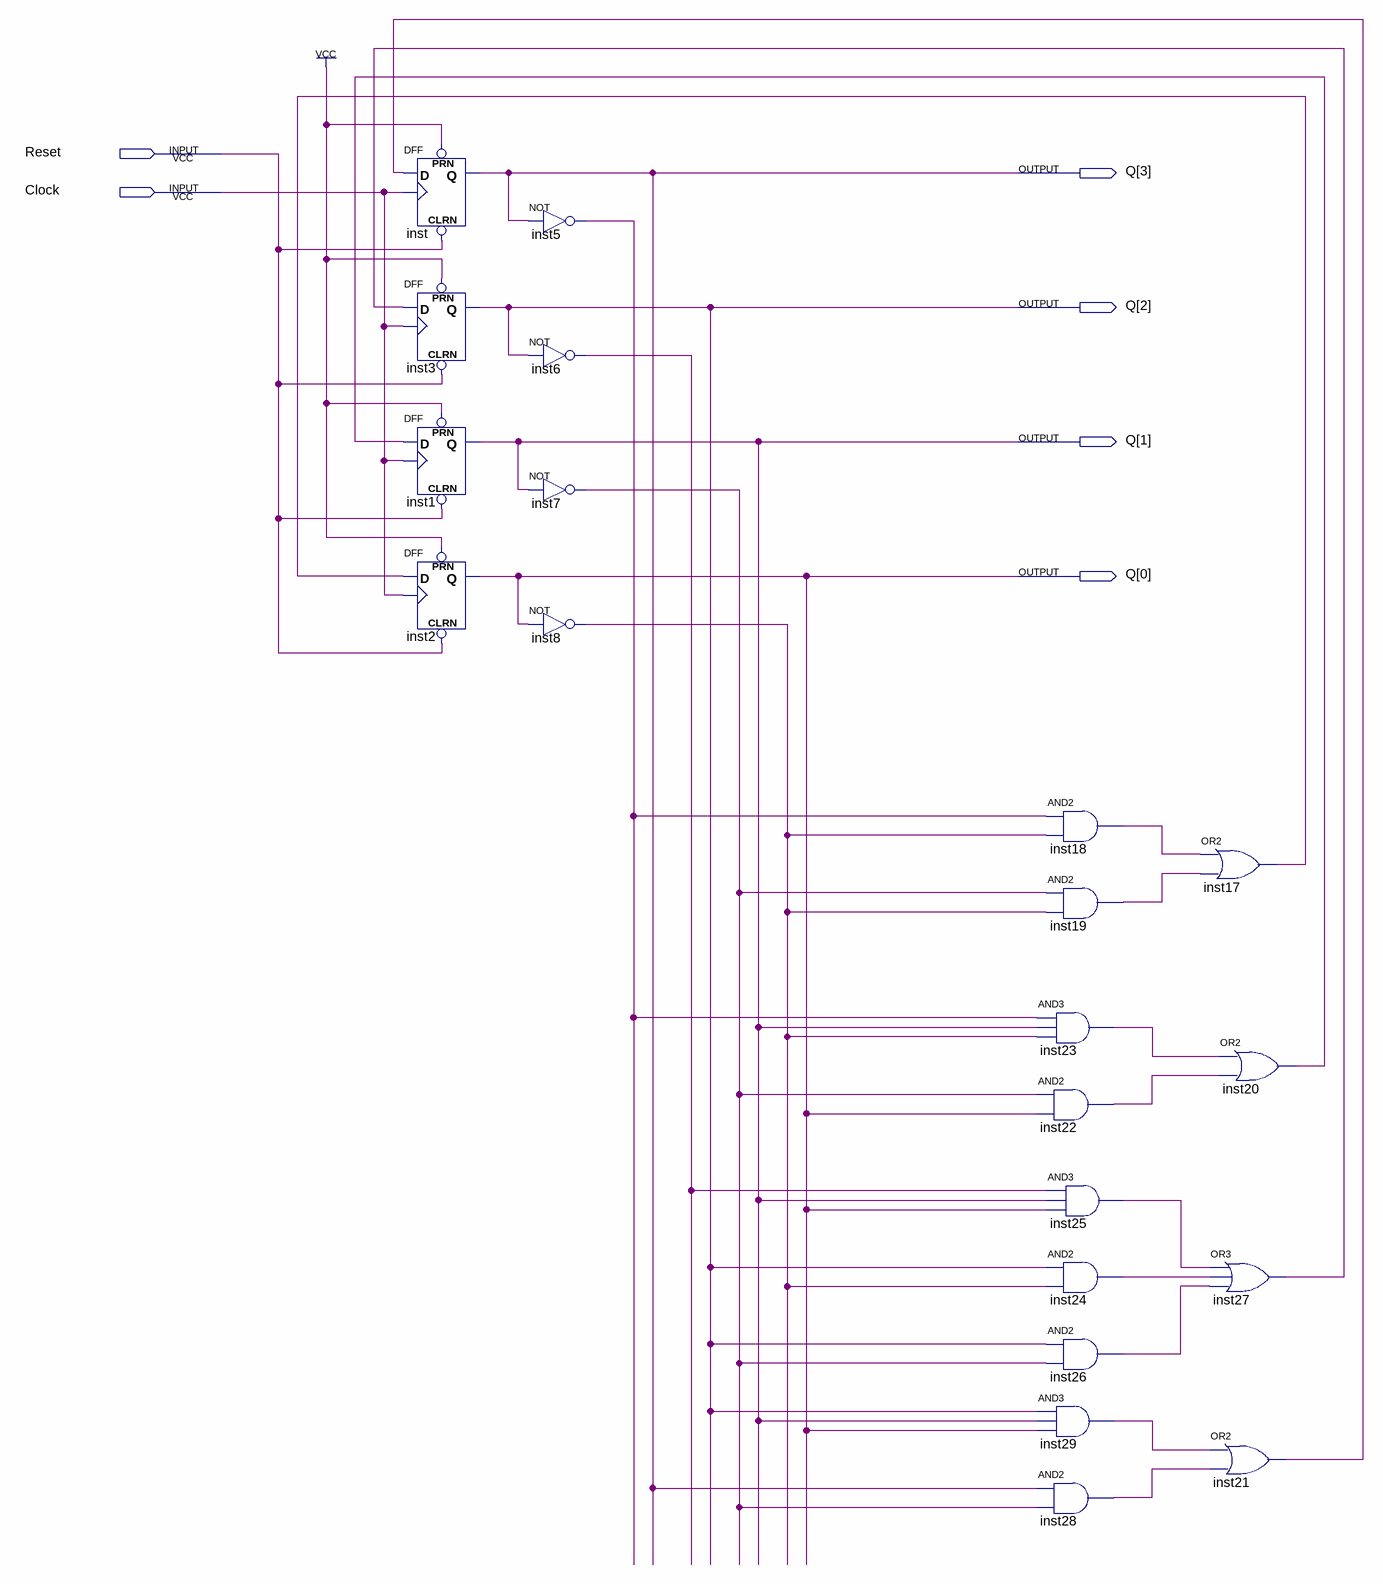
[diagram p0: schematic sheet]
// Quartus schematic Contsic.bdf as structural Verilog: 21 symbols, 6 pins
module Contsic (
  input  Reset,
  input  Clock,
  output [3:0] Q
);

  wire inst5_out, inst6_out, inst7_out, inst8_out, inst17_out, inst18_out, inst19_out, inst20_out,
       inst21_out, inst22_out, inst23_out, inst24_out, inst25_out, inst26_out, inst27_out, inst28_out,
       inst29_out;

  DFF inst (.CLRN(Reset), .CLK(Clock), .D(inst21_out), .PRN(1'b1), .Q(Q[3]));
  DFF inst3 (.CLRN(Reset), .CLK(Clock), .D(inst27_out), .PRN(1'b1), .Q(Q[2]));
  DFF inst1 (.CLRN(Reset), .CLK(Clock), .D(inst20_out), .PRN(1'b1), .Q(Q[1]));
  DFF inst2 (.CLRN(Reset), .CLK(Clock), .D(inst17_out), .PRN(1'b1), .Q(Q[0]));
  not inst5 (inst5_out, Q[3]);
  not inst6 (inst6_out, Q[2]);
  not inst7 (inst7_out, Q[1]);
  not inst8 (inst8_out, Q[0]);
  and inst18 (inst18_out, inst5_out, inst8_out);
  and inst19 (inst19_out, inst7_out, inst8_out);
  and inst23 (inst23_out, inst5_out, Q[1], inst8_out);
  and inst22 (inst22_out, inst7_out, Q[0]);
  and inst25 (inst25_out, inst6_out, Q[1], Q[0]);
  and inst24 (inst24_out, Q[2], inst8_out);
  and inst26 (inst26_out, Q[2], inst7_out);
  and inst29 (inst29_out, Q[2], Q[1], Q[0]);
  and inst28 (inst28_out, Q[3], inst7_out);
  or inst17 (inst17_out, inst18_out, inst19_out);
  or inst20 (inst20_out, inst23_out, inst22_out);
  or inst27 (inst27_out, inst25_out, inst24_out, inst26_out);
  or inst21 (inst21_out, inst29_out, inst28_out);
endmodule
